# EasyEDA schematic Test Sled Pad Valves Schematic EasyEDA.json
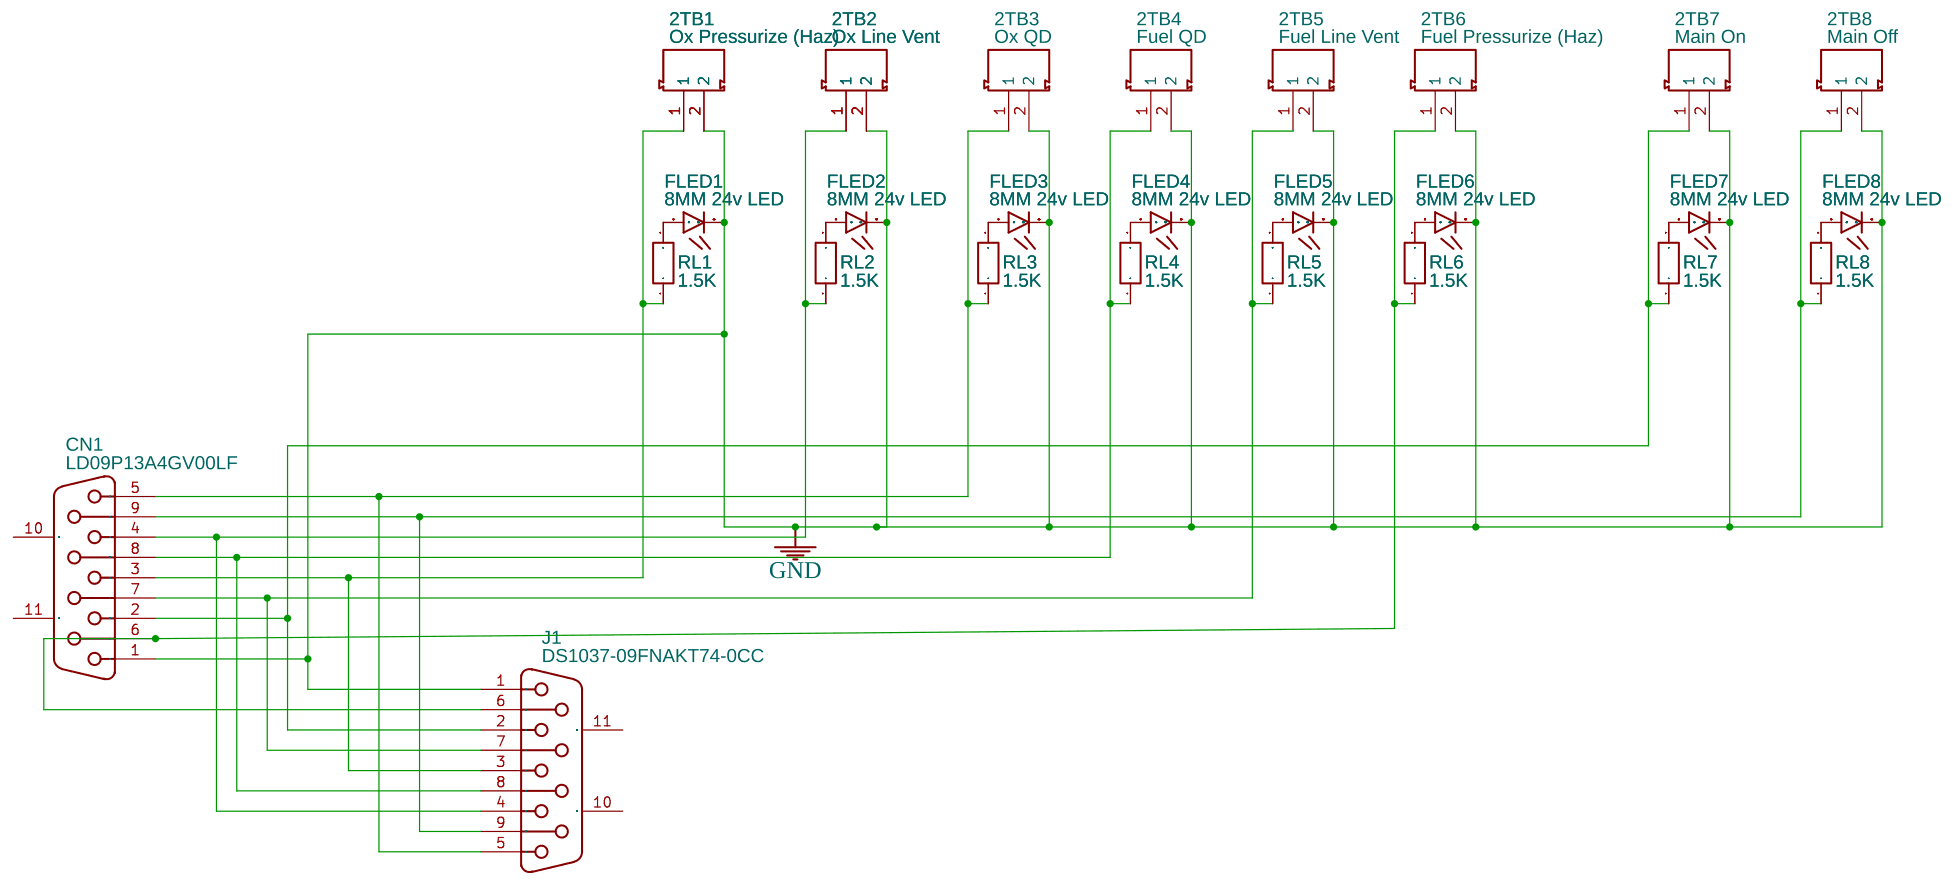
[diagram p0: schematic sheet]

## Parts
2TB1  Ox Pressurize (Haz)  [1729128]
2TB2  Ox Line Vent  [1729128]
2TB3  Ox QD  [1729128]
2TB4  Fuel QD  [1729128]
2TB5  Fuel Line Vent  [1729128]
2TB6  Fuel Pressurize (Haz)  [1729128]
2TB7  Main On  [1729128]
2TB8  Main Off  [1729128]
CN1  LD09P13A4GV00LF  [DB9-TH_LD09P13A4GV00LF]
FLED1  8MM 24v LED  [LED8MM_MB]
FLED2  8MM 24v LED  [LED8MM_MB]
FLED3  8MM 24v LED  [LED8MM_MB]
FLED4  8MM 24v LED  [LED8MM_MB]
FLED5  8MM 24v LED  [LED8MM_MB]
FLED6  8MM 24v LED  [LED8MM_MB]
FLED7  8MM 24v LED  [LED8MM_MB]
FLED8  8MM 24v LED  [LED8MM_MB]
J1  DS1037-09FNAKT74-0CC  [DSUB-TH_DS1037-09FNAKT74-0CC]
RL1  1.5K  [R0603]
RL2  1.5K  [R0603]
RL3  1.5K  [R0603]
RL4  1.5K  [R0603]
RL5  1.5K  [R0603]
RL6  1.5K  [R0603]
RL7  1.5K  [R0603]
RL8  1.5K  [R0603]

## Library data of the parts
2TB1-2TB8 = 1729128: Supplier: Digi-Key; Supplier Part: 277-1247-ND; Manufacturer: Phoenix Contact; Contributor: LCSC
CN1 = LD09P13A4GV00LF: Supplier: LCSC; Supplier Part: C599388; Manufacturer: Amphenol; link: https://atta.szlcsc.comnull; Contributor: lcsc
FLED1-FLED8 = P804JPF4D: Mounted: No
J1 = DS1037-09FNAKT74-0CC: Supplier: LCSC; Manufacturer: CONNFLY; Supplier Part: C75749; JLCPCB Part Class: Extended Part
RL1-RL8 = SFR03EZPF1001: Supplier: LCSC; Supplier Part: C2941038; Manufacturer: ROHM(罗姆); Contributor: lcsc

## Nets
GND: 2TB1.2 2TB2.2 2TB3.2 2TB4.2 2TB5.2 2TB6.2 2TB7.2 2TB8.2 CN1.1 FLED1.CATHODE FLED2.CATHODE FLED3.CATHODE FLED4.CATHODE FLED5.CATHODE FLED6.CATHODE FLED7.CATHODE FLED8.CATHODE J1.1
Net-(2TB1-1): 2TB1.1 CN1.3 J1.3 RL1.1
Net-(2TB2-1): 2TB2.1 CN1.4 J1.4 RL2.1
Net-(2TB3-1): 2TB3.1 CN1.5 J1.5 RL3.1
Net-(2TB4-1): 2TB4.1 CN1.8 J1.8 RL4.1
Net-(2TB5-1): 2TB5.1 CN1.7 J1.7 RL5.1
Net-(2TB6-1): 2TB6.1 CN1.6 J1.6 RL6.1
Net-(2TB7-1): 2TB7.1 CN1.2 J1.2 RL7.1
Net-(2TB8-1): 2TB8.1 CN1.9 J1.9 RL8.1
Net-(FLED1-ANODE): FLED1.ANODE RL1.2
Net-(FLED2-ANODE): FLED2.ANODE RL2.2
Net-(FLED3-ANODE): FLED3.ANODE RL3.2
Net-(FLED4-ANODE): FLED4.ANODE RL4.2
Net-(FLED5-ANODE): FLED5.ANODE RL5.2
Net-(FLED6-ANODE): FLED6.ANODE RL6.2
Net-(FLED7-ANODE): FLED7.ANODE RL7.2
Net-(FLED8-ANODE): FLED8.ANODE RL8.2

Not connected (* = marked no-connect by the designer): CN1 10(MH1) 11(MH2); J1 10(MH1) 11(MH2)
